# Altium schematic sheet kernel_RJ45.SchDoc
size A4
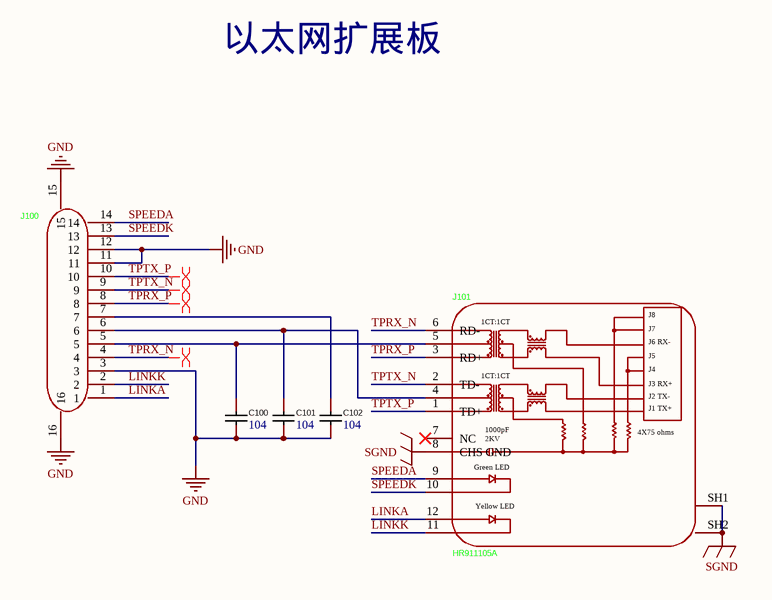
[diagram p0: kernel_RJ45.SchDoc]

## Parts
C100  104  [0402_C]
C101  104  [0402_C]
C102  104  [0402_C]
J100  AFC01-S14FCA-00  [FPC-SMD_AFC01-S14FCA-00]  (value not drawn)
J101  HR911105A  [RJ45-TH_HR911105A]

## Nets
GND: C100.1 C101.1 C102.1 J100.3 J100.11 J100.12 J100.15 J100.16
SGND: J101.8(CHS_GND) J101.SH1 J101.SH2
LINKA: J100.1 J101.12
LINKK: J100.2 J101.11
SPEEDA: J100.14 J101.9
SPEEDK: J100.13 J101.10
TPRX_N: J100.4 J101.6(RD-)
TPRX_P: J100.8 J101.3(RD+)
TPTX_N: J100.9 J101.2(TD-)
TPTX_P: J100.10 J101.1(TD+)
NetC100_2: C100.2 J100.5 J101.5
NetC101_2: C101.2 J100.6 J101.4
NetC102_2: C102.2 J100.7

Not connected (* = marked no-connect by the designer): J101 7(NC)*

## Layout directives
differential pair: TPRX_N, TPRX_P, TPTX_N, TPTX_P

## Notes on the sheet
- 以太网扩展板
- (in symbol HR911105A_C12074) J8; 1CT:1CT; J7; J6 RX-; J5; J4; J3 RX+; J2 TX-; J1 TX+; 1000pF; 4X75 ohms; 2KV; Green LED; Yellow LED

## Library data of the parts
C100-C102 = 0402C_104: 电容100nf; Manufacturer: FH(风华); Name: 20pF; Symbol: 0402CG200J500NT; Add into BOM: yes; Value: 20pF; Tolerance: ±5%; Voltage Rated: 50V; Temperature Coefficient: C0G; Device: 0402CG200J500NT; LCSC Part Name: 20pF ±5% 50V; Supplier Part: C1554; Manufacturer Part: 0402CG200J500NT; Supplier Footprint: 0402; JLCPCB Part Class: Basic Part; Datasheet: https://atta.szlcsc.com/upload/public/pdf/source/20170923/C1554_1506149268708988361.pdf; Supplier: LCSC; Convert to PCB: yes
J100 = AFC01-S14FCA-00: FPC; Manufacturer: JS(钜硕电子); Add into BOM: yes; Locking Feature: 翻盖式; Number of Contacts: 14P; Pitch: 0.5mm; FFC, FCB Thickness: 0.3mm; Symbol: AFC01-S14FCA-00; Device: AFC01-S14FCA-00; LCSC Part Name: 间距:0.5mm P数:14P 翻盖式 下接; Supplier Part: C262663; Manufacturer Part: AFC01-S14FCA-00; Supplier Footprint: SMD,P=0.5mm,卧贴; JLCPCB Part Class: Extended Part; Datasheet: https://atta.szlcsc.com/upload/public/pdf/source/20190816/C413942_2A72D1AC756EAE17EEDF756A339D4500.pdf; Supplier: LCSC; Convert to PCB: yes; Contact Type: 下接; Mounting Type: 卧贴; Height Above Board: 2mm; Operating Temperature Range: -
J101 = HR911105A_C12074: Manufacturer: HANRUN(汉仁); Add into BOM: yes; Connector Type: RJ45插座; Number of Ports: 1; LED: 带LED; PoE: 不带PoE; Supplementary Features: 带滤波; Symbol: HR911105A_C12074; Device: HR911105A_C12074; LCSC Part Name: 带LED; Supplier Part: C12074; Manufacturer Part: HR911105A; Supplier Footprint: 插件; JLCPCB Part Class: Extended Part; Datasheet: https://item.szlcsc.com/datasheet/HR911105A/12651.html; Supplier: LCSC; Convert to PCB: yes; Mounting Type: -; Shielding: -; Ratings: -; Contact Material: -; Contact Plating: -; Operating Temperature: -